# EAGLE design OScope_SoundCard (EAGLE 9.6.1)
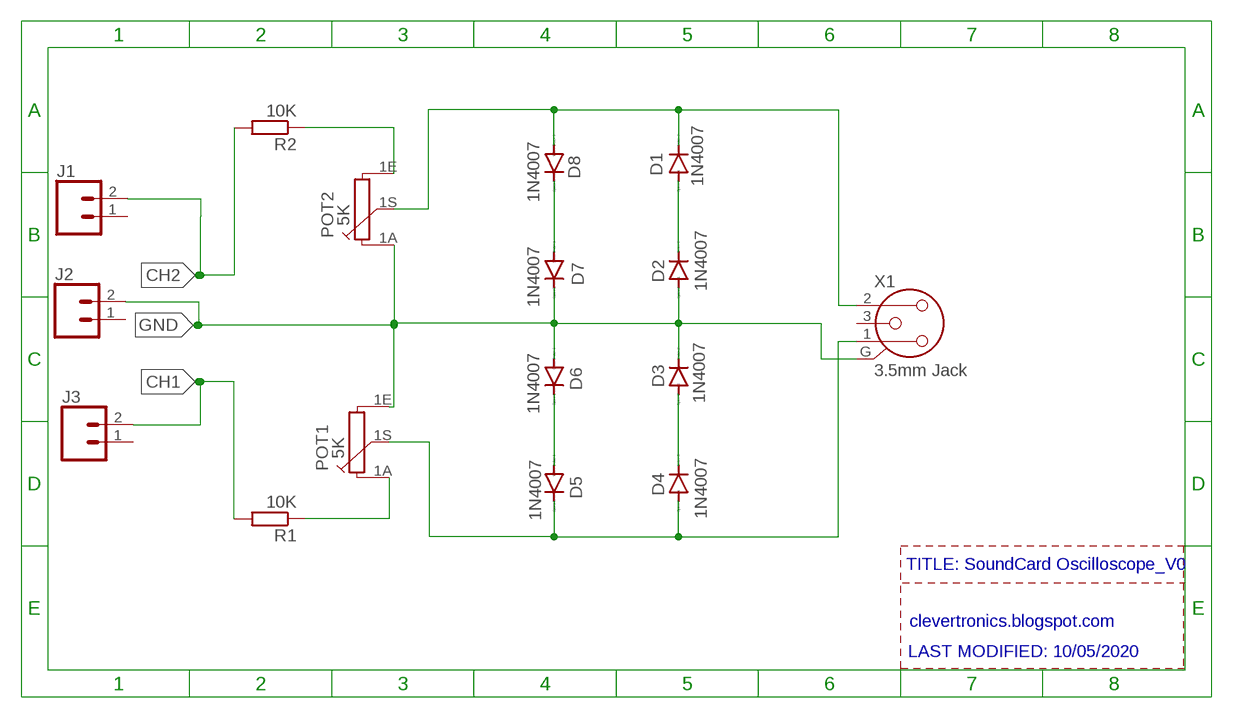
[diagram p0: schematic, sheet 1]

## Parts
D1  1N4007  1N4004  [DO41-10]
D2  1N4007  1N4004  [DO41-10]
D3  1N4007  1N4004  [DO41-10]
D4  1N4007  1N4004  [DO41-10]
D5  1N4007  1N4004  [DO41-10]
D6  1N4007  1N4004  [DO41-10]
D7  1N4007  1N4004  [DO41-10]
D8  1N4007  1N4004  [DO41-10]
J1  CONN_023.5MM  [SCREWTERMINAL-3.5MM-2]
J2  CONN_023.5MM  [SCREWTERMINAL-3.5MM-2]
J3  CONN_023.5MM  [SCREWTERMINAL-3.5MM-2]
POT1  5K  PC16S  [PC16S]
POT2  5K  PC16S  [PC16S]
R1  10K  R-EU_0207/10  [0207/10]
R2  10K  R-EU_0207/10  [0207/10]
X1  3.5mm Jack  NC3FAH2  [NC3FAH2]

## Nets
CH1: J3.2 R1.2
CH2: J1.2 R2.2
N$1: D5.A D6.C
N$2: D3.A D4.C
N$3: D4.A D5.C POT1.1S X1.1
N$4: D2.A D3.C D6.A D7.C J2.2 POT1.1E POT2.1A X1.G
N$5: D7.A D8.C
N$6: D1.A D2.C
N$7: D1.C D8.A POT2.1S X1.2
N$8: POT1.1A R1.1
N$9: POT2.1E R2.1
Unconnected: J1.1 J2.1 J3.1 X1.3

## Notes on the sheet
- TITLE: SoundCard Oscilloscope_V0
- clevertronics.blogspot.com
- LAST MODIFIED: 10/05/2020

## Library data of the parts
D1-D8 = diode:1N4004: DIODE general purpose rectifier, 1 A
J1-J3 = SparkFun-Connectors:CONN_02: Multi connection point. Often used as Generic Header-pin footprint for 0.1 inch spaced/style header connections On any of the 0.1 inch spaced packages, you can populate with these: Break Away Headers - Straight <https://www.sparkfun.com/products/116> (PRT-00116) Break Away Male Headers - Right Angle <https://www.sparkfun.com/products/553> (PRT-00553) Female Headers <https://www.sparkfun.com/products/115> (PRT-00115) Break Away Headers - Machine Pin <https://www.sparkfun.com/products/117> (PRT-00117) Break Away Female Headers - Swiss Machine Pin <https://www.sparkfun.com/products/743> (PRT-00743) For SCREWTERMINALS and SPRING TERMINALS visit here: Screw Terimnals on SparkFun.com <https://www.sparkfun.com/search/results?term=Screw+Terminals> (5mm/3.5mm/2.54mm spacing) This device is also useful as a general connection point to wire up your design to another part of your project. Our various solder wires solder well into these plated through hole pads. Hook-Up Wire - Assortment (Stranded, 22 AWG) <https://www.sparkfun.com/products/11375> (PRT-11375) Hook-Up Wire - Assortment (Solid Core, 22 AWG) <https://www.sparkfun.com/products/11367> (PRT-11367) View the entire wire category on our website here <https://www.sparkfun.com/categories/141> Special notes: Molex polarized connector foot print use with: PRT-08233 with associated crimp pins and housings. 2.54_SCREWTERM for use with PRT-10571. 3.5mm Screw Terminal footprints for PRT-08084 5mm Screw Terminal footprints for use with PRT-08432; PROD_ID: CONN-08399
POT1 POT2 = piher:PC16S: POTENTIOMETER single carbon potentiometer, 16 mm, S3ROH; OC_FARNELL: 4452940; OC_NEWARK: unknown
R1 R2 = rcl:R-EU_: RESISTOR, European symbol; SPICEPREFIX: R
X1 = con-neutrik_ag:NC3: Neutrik Audio Connector XLR SERIES Stereo 1/4" jack Source: www.neutrik.com/; MPN: NC3FAH2; OC_FARNELL: unknown; OC_NEWARK: 27B4208

## Board
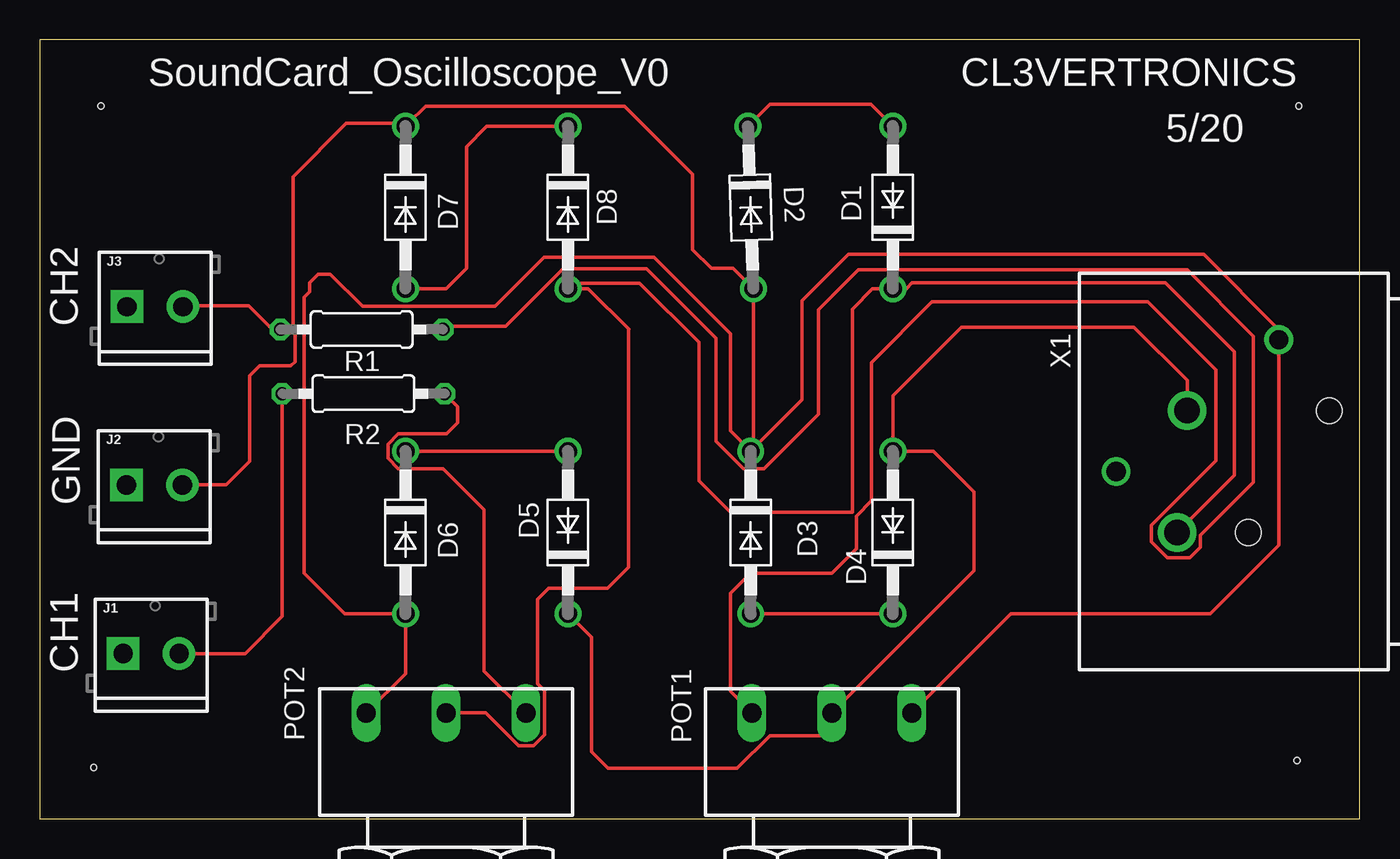
[diagram p1: board, top side]

Size 82.53 x 48.69 mm. Coordinates in mm from the lower left corner, seen from the top.
Outline: 0,0 82.53,0 82.53,48.69 0,48.69 0,0
Copper layers (1*16): Top 0.035mm / dielectric 1.5mm / Bottom 0.035mm
Design rules "default": minimum track width 6mil, minimum drill 0.35mm, track to track 6mil, track to pad 6mil, pad to pad 6mil, via to via 6mil, smd to smd 6mil, copper to edge 40mil, drill to drill 6mil, minimum pad ring 10mil, minimum via ring 8mil, stop-mask expansion 4mil, vias tented up to drill 0mil, thermal gap 10mil
Holes 0.35 mm at 78.74,44.57 3.81,44.57 3.36,3.21 78.63,3.64

### Footprints (pad centres in the part's own frame; a part is rotated, then mirrored left to right if it is on the bottom)
DO41-10 = drill 1.118: A 5.08,0; C -5.08,0
SCREWTERMINAL-3.5MM-2 = drill 1.2 pad 2.032 square: 1 0,0 | drill 1.2 pad 2.032: 2 3.5,0
PC16S = drill 1.2 long: 1A -5,6.5; 1E 5,6.5; 1S 0,6.5
0207/10 = drill 0.813 octagon: 1 -5.08,0; 2 5.08,0
NC3FAH2 = drill 1.6: 1 -3.81,0.635; 2 3.81,0 | drill 1.2: 3 0,-3.815; G -8.25,6.355 | hole 1.6: -3.81,9.525; 3.81,4.445

### Placement (x,y rotation side)
D1  53.34,38.22 90 top
D2  44.45,38.22 271.9 top
D3  44.45,17.9 270 top
D4  53.34,17.9 90 top
D5  33.02,17.9 90 top
D6  22.86,17.9 270 top
D7  22.86,38.22 270 top
D8  33.02,38.22 270 top
J1  5.21,10.33 0 top
J2  5.41,20.87 0 top
J3  5.44,32.02 0 top
POT1  49.53,0.12 0 top
POT2  25.4,0.12 0 top
R1  20.12,30.59 180 top
R2  20.23,26.58 180 top
X1  71.12,21.71 270 top

### Tracks (layer width: path | path; a pad name or v marks a point on that pad's centre or on a via)
CH1
  Top 0.203: 14.53,30.6 15.03,30.1 14.53,30.59 | R1.2 14.53,30.59 | 14.53,30.59 13.06,32.07 9,32.07 J3.2
CH2
  Top 0.203: R2.2 15.15,21.57 15.16,21.55 15.16,12.66 12.84,10.33 J1.2
N$1
  Top 0.203: D6.C D5.A
N$2
  Top 0.203: D3.A D4.C
N$3
  Top 0.203: X1.1 71.75,27.41 68.42,30.75 57.62,30.75 53.34,26.46 D4.A 55.88,22.98 58.42,20.44 58.42,15.51 POT1.1S 49.53,5.2 45.64,5.2 43.59,3.15 35.52,3.15 34.49,4.18 34.49,11.35 D5.C
N$4
  Top 0.203: D7.C 23.03,43.48 | 23.03,43.48 24.11,44.56 36.57,44.56 40.82,40.3 40.82,35.59 42,34.41 43.35,34.41 D2.A 44.62,23.15 D3.C | 77.48,18.69 77.48,30.59 72.78,35.29 50.56,35.29 47.67,32.39 47.67,26.2 D3.C | D6.A 22.86,10.28 | 54.61,6.7 POT1.1E 60.73,12.82 73.2,12.82 77.48,17.11 77.48,18.69 | D6.A 22.86,9.08 POT2.1A | D6.A 19.05,12.82 16.51,15.36 16.51,32.6 16.87,32.95 16.87,33.52 17.4,34.05 18.16,34.05 20.17,32.05 28.46,32.05 31.53,35.12 38.39,35.12 43.18,30.34 43.18,24.25 D3.C | X1.G 77.47,18.7 77.48,18.69 | 23.03,43.48 19.16,43.48 15.83,40.14 15.83,30.59 15.95,30.46 15.95,28.58 15.69,28.32 13.73,28.32 13.13,27.72 13.13,22.35 11.66,20.87 J2.2
N$5
  Top 0.203: D7.A 25.4,33.14 26.67,34.41 26.67,42.03 27.94,43.3 D8.C
N$6
  Top 0.203: D2.C 45.65,44.66 51.98,44.66 D1.A
N$7
  Top 0.203: X1.2 74.69,21.47 74.69,29.21 70.39,33.51 54.55,33.51 54.18,33.14 D1.C 52.07,33.14 50.8,31.87 50.8,19.17 43.18,19.17 41.21,21.14 41.21,29.79 37.51,33.49 33.37,33.49 D8.A 34.29,33.14 36.83,30.6 36.83,15.74 35.51,14.42 31.8,14.42 31.11,13.74 31.11,8.44 31.55,8 31.55,5.24 30.88,4.57 29.92,4.57 27.87,6.62 POT2.1S
N$8
  Top 0.203: R1.1 25.4,30.79 29.12,30.79 32.72,34.39 37.93,34.39 42.27,30.05 42.27,23.62 44,21.89 45.3,21.89 48.69,25.28 48.69,31.82 51.19,34.32 71.75,34.32 75.89,30.18 75.89,21.03 72.57,17.72 72.57,16.97 71.92,16.32 70.5,16.32 69.51,17.31 69.51,18.35 73.53,22.37 73.53,28.09 69.3,32.32 55.8,32.32 52,28.52 52,19.87 51.05,18.92 51.05,16.88 49.53,15.36 44.45,15.36 43.18,14.09 43.18,7.97 POT1.1A
N$9
  Top 0.203: POT2.1E 27.78,9.24 27.78,19.33 25.22,21.89 22.41,21.89 21.77,22.53 21.77,23.43 22.41,24.07 25.42,24.07 26.11,24.77 26.11,25.77 R2.1

### Text on the board
tNames: SoundCard_Oscilloscope_V0 | CL3VERTRONICS | 5/20 | CH2 | GND | CH1